# Altium project TIDA-010967_xWRL6432AOP_Module_revB.PrjPcb (part 1 of 3)
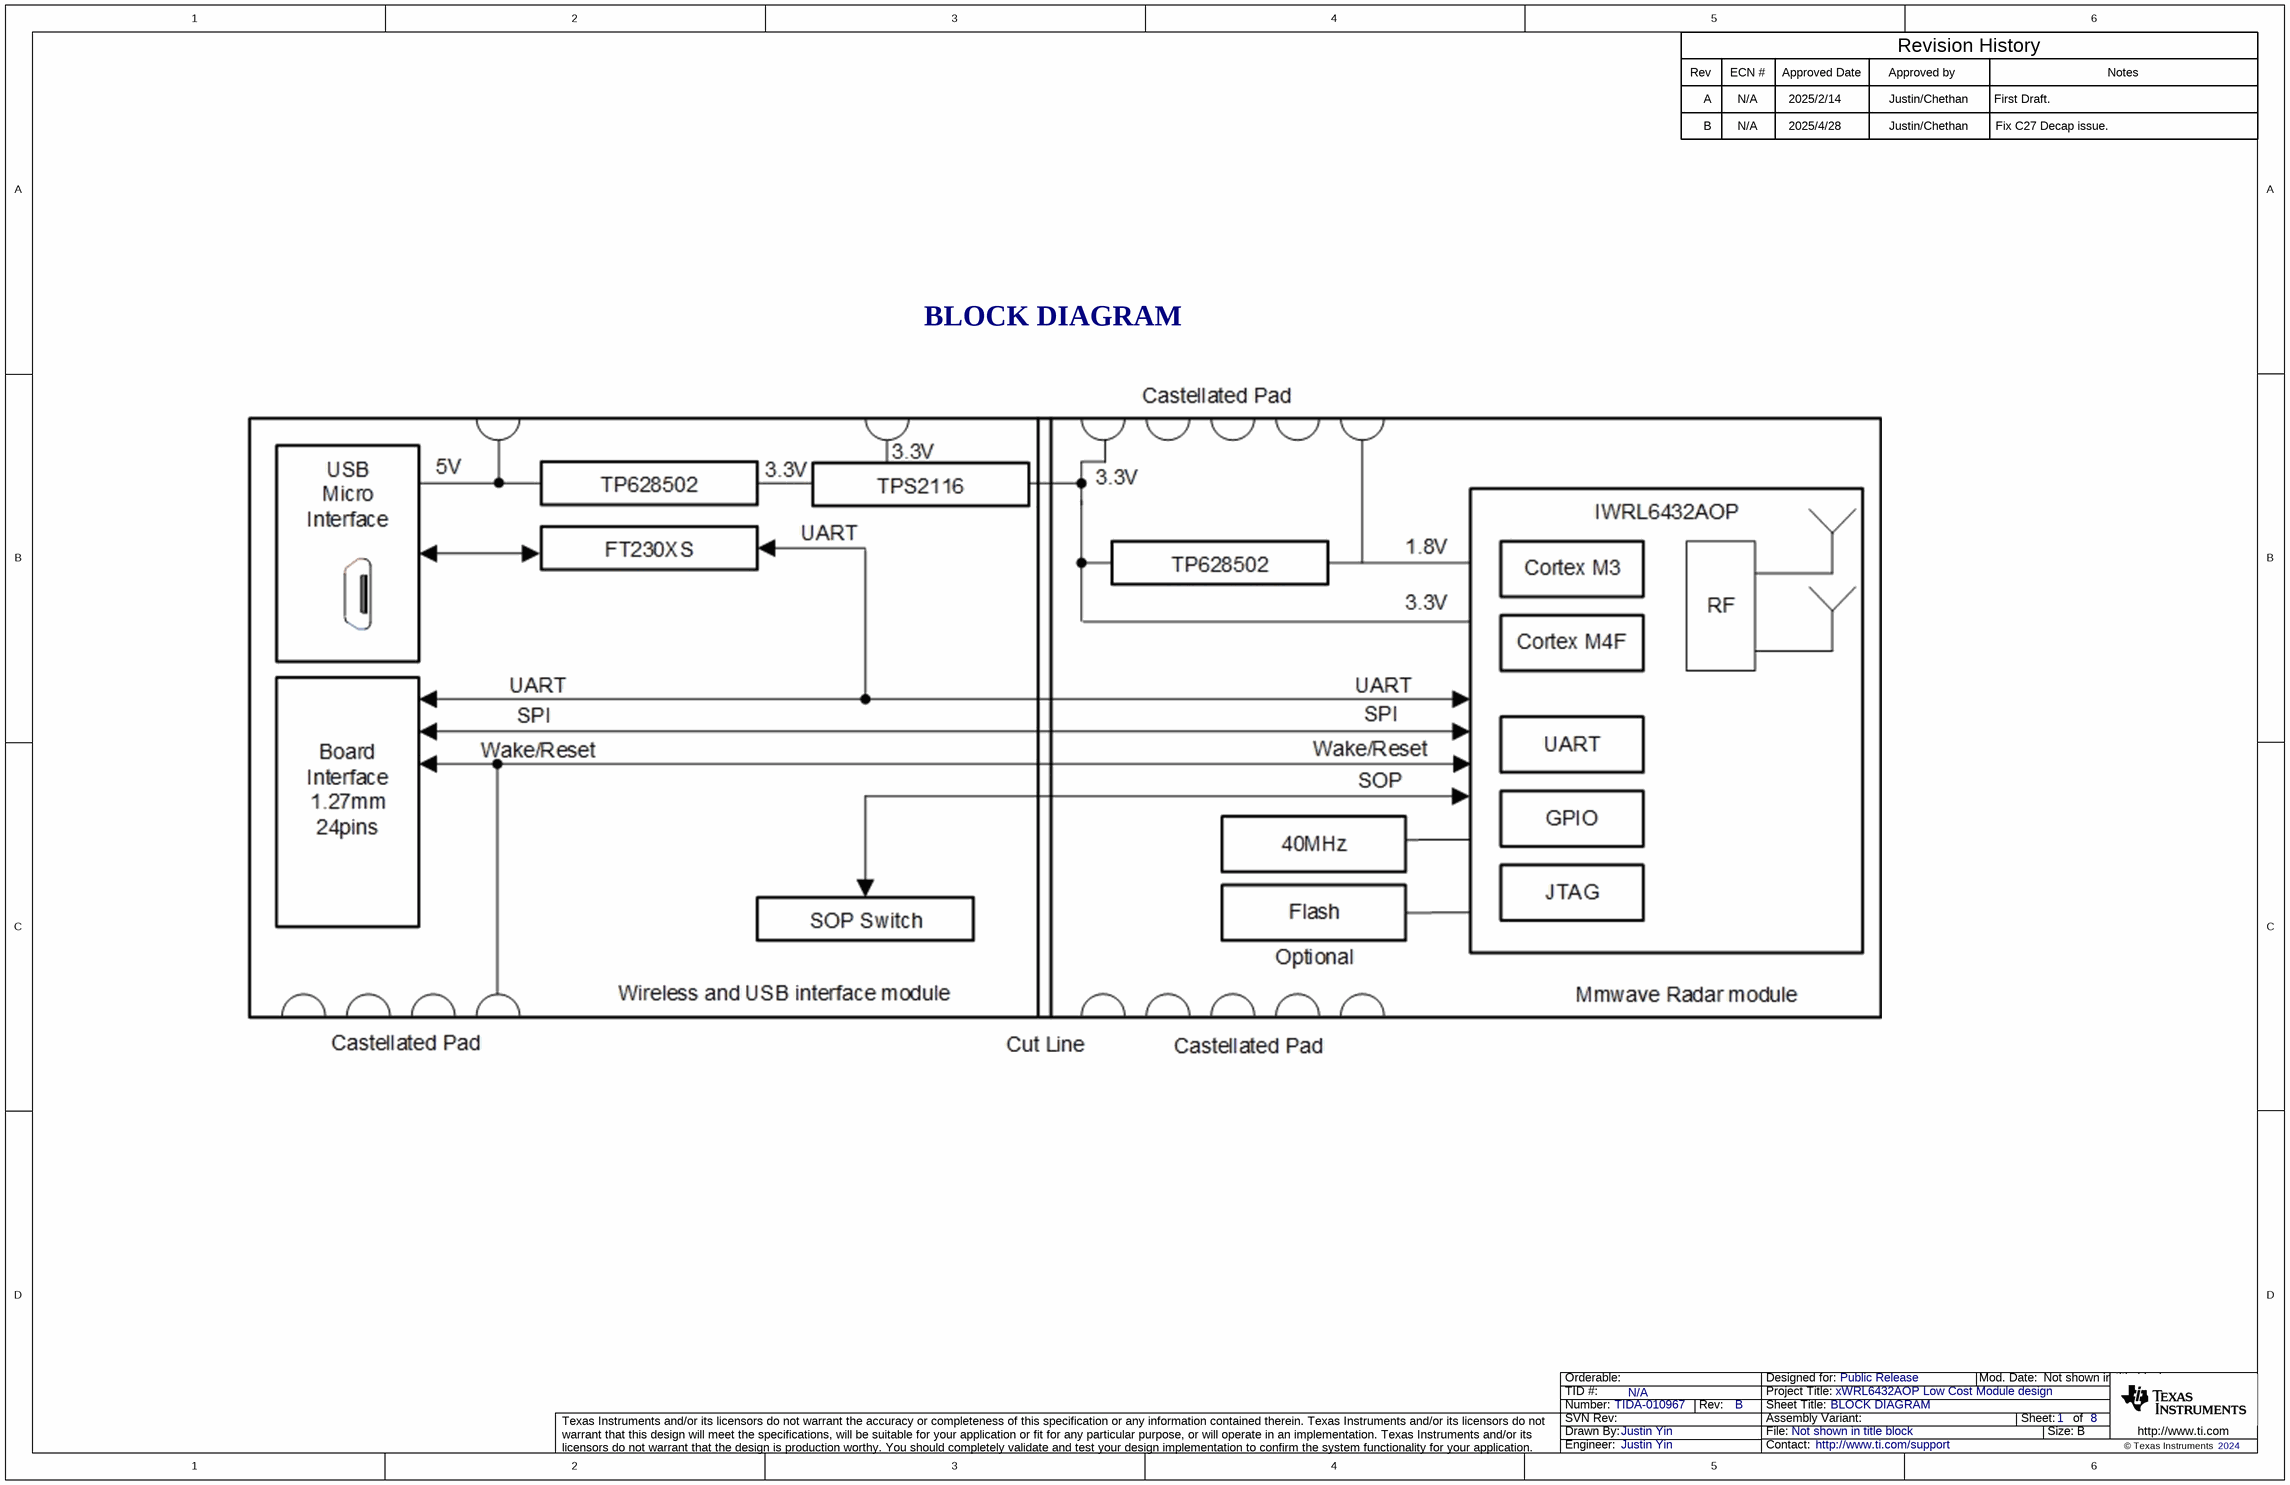
[diagram p0: TIDA-010967_Diagram.SchDoc]
CopyrightYear: 2024; PCB_Layout: Justin Yin; PCB_Rev: B; PRJ_Customer: Public Release; PRJ_Engineer: Justin Yin; PRJ_Number: TIDA-010967; PRJ_Title: xWRL6432AOP Low Cost Module design; SCH_Rev: B; TechSupport: http://www.ti.com/support; TID: N/A
8 sheets, 179 parts. Net scope: flat (ports and power ports of the same name join across sheets).
Board file: TIDA-010967_PCB.PcbDoc
Sheets:
  TIDA-010967_Diagram.SchDoc
  TIDA-010967_Table_Of_Contents.SchDoc
  TIDA-010967_USB_PWR_Connector.SchDoc
  TIDA-010967_DC_Regulators.SchDoc
  TIDA-010967_xWRL6432_Chip.SchDoc
  TIDA-010967_Decoupling_caps.SchDoc
  TIDA-010967_QSPI_Flash.SchDoc
  TIDA-010967_Hardware.SchDoc

## Sheet TIDA-010967_Diagram.SchDoc: BLOCK DIAGRAM
size 431 x 279 mm; Date: Not shown in title block; ApprovedBy: Not shown in title block; CheckedBy: Not shown in title block; Author: Not shown in title block; CompanyName: Not shown in title block; DrawnBy: Justin Yin; Organization: Not shown in title block; Address1: Not shown in title block; Address2: Not shown in title block; Address3: Not shown in title block; Address4: Not shown in title block; DocumentNumber: 1; Revision: Use project parameter SCH_Rev; SheetNumber: 1; SheetTotal: 8; PageSetup: Record=PageOptions|CenterHorizontal=True|CenterVertical=True|PrintScale=1.00|XCorrection=1.00|YCorrection=1.00|PrintKind=0|BorderSize=5000000|LeftOffset=0|BottomOffset=0|Orientation=2|PaperLength=1000|PaperWidth=1000|Scale=100|PaperSource=15|PrintQuality=600|MediaType=1|DitherType=10|PaperKind=Letter|PrintScaleMode=1; CurrentTime: Not shown in title block; CurrentDate: Not shown in title block; Time: Not shown in title block; DocumentFullPathAndName: Not shown in title block; DocumentName: Not shown in title block; ModifiedDate: Not shown in title block; ImagePath: Not shown in title block

### Notes on the sheet
- Rev
- A
- ECN #
- N/A
- 2025/2/14
- Approved Date
- Approved by
- Justin/Chethan
- Revision History
- First Draft.
- Notes
- B
- 2025/4/28
- Fix C27 Decap issue.
- BLOCK DIAGRAM
- Drawn By:
- SVN Rev:
- Number:
- TID #:
- Orderable:
- Rev:
- Sheet Title:
- File:
- Project Title:
- Designed for:
- Assembly Variant:
- Mod. Date:
- Sheet:
- Size:
- of
- http://www.ti.com
- Texas Instruments and/or its licensors do not warrant the accuracy or completeness of this specification or any information contained therein. Texas Instruments and/or its licensors do not warrant that this design will meet the specifications, will be suitable for your application or fit for any particular purpose, or will operate in an implementation. Texas Instruments and/or its licensors do not warrant that the design is production worthy. You should completely validate and test your design implementation to confirm the system functionality for your application.
- Engineer:
- Contact:
- © Texas Instruments

## Sheet TIDA-010967_Table_Of_Contents.SchDoc: TABLE OF CONTENTS
size 431 x 279 mm; Date: Not shown in title block; ApprovedBy: Not shown in title block; CheckedBy: Not shown in title block; Author: Not shown in title block; CompanyName: Not shown in title block; DrawnBy: Justin Yin; Engineer: Not shown in title block; Organization: Not shown in title block; Address1: Not shown in title block; Address2: Not shown in title block; Address3: Not shown in title block; Address4: Not shown in title block; DocumentNumber: 2; Revision: Use project parameter SCH_Rev; SheetNumber: 2; SheetTotal: 8; PageSetup: Record=PageOptions|CenterHorizontal=True|CenterVertical=True|PrintScale=1.00|XCorrection=1.00|YCorrection=1.00|PrintKind=0|BorderSize=5000000|LeftOffset=0|BottomOffset=0|Orientation=2|PaperLength=1000|PaperWidth=1000|Scale=100|PaperSource=15|PrintQuality=600|MediaType=1|DitherType=10|PaperKind=Letter|PrintScaleMode=1; CurrentTime: Not shown in title block; CurrentDate: Not shown in title block; Time: Not shown in title block; DocumentFullPathAndName: Not shown in title block; DocumentName: Not shown in title block; ModifiedDate: Not shown in title block; ImagePath: Not shown in title block
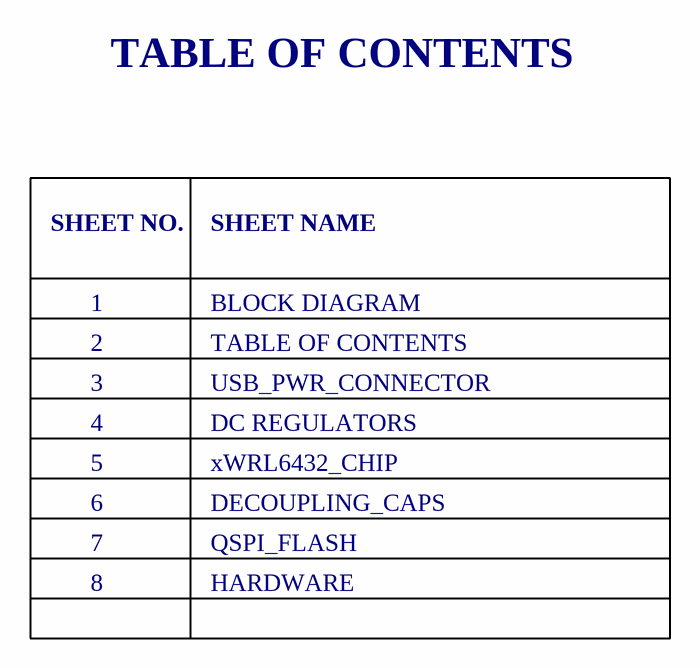
[diagram p1: TIDA-010967_Table_Of_Contents.SchDoc]

### Notes on the sheet
- TABLE OF CONTENTS
- SHEET NO.
- SHEET NAME
- 1
- 2
- 3
- BLOCK DIAGRAM
- USB_PWR_CONNECTOR
- 4
- 5
- DC REGULATORS
- xWRL6432_CHIP
- 7
- 8
- 6
- DECOUPLING_CAPS
- QSPI_FLASH
- HARDWARE
- Drawn By:
- SVN Rev:
- Number:
- TID #:
- Orderable:
- Rev:
- Sheet Title:
- File:
- Project Title:
- Designed for:
- Assembly Variant:
- Mod. Date:
- Sheet:
- Size:
- of
- B
- http://www.ti.com
- Texas Instruments and/or its licensors do not warrant the accuracy or completeness of this specification or any information contained therein. Texas Instruments and/or its licensors do not warrant that this design will meet the specifications, will be suitable for your application or fit for any particular purpose, or will operate in an implementation. Texas Instruments and/or its licensors do not warrant that the design is production worthy. You should completely validate and test your design implementation to confirm the system functionality for your application.
- Engineer:
- Contact:
- © Texas Instruments

## Sheet TIDA-010967_USB_PWR_Connector.SchDoc: USB_PWR_Connector
size 431 x 279 mm; Date: Not shown in title block; ApprovedBy: Not shown in title block; CheckedBy: Not shown in title block; Author: Not shown in title block; CompanyName: Not shown in title block; DrawnBy: Justin Yin; Engineer: Not shown in title block; Organization: Not shown in title block; Address1: Not shown in title block; Address2: Not shown in title block; Address3: Not shown in title block; Address4: Not shown in title block; DocumentNumber: 3; Revision: Use project parameter SCH_Rev; SheetNumber: 3; SheetTotal: 8; PageSetup: Record=PageOptions|CenterHorizontal=True|CenterVertical=True|PrintScale=1.00|XCorrection=1.00|YCorrection=1.00|PrintKind=0|BorderSize=5000000|LeftOffset=0|BottomOffset=0|Orientation=2|PaperLength=1000|PaperWidth=1000|Scale=100|PaperSource=15|PrintQuality=600|MediaType=1|DitherType=10|PaperKind=Letter|PrintScaleMode=1; CurrentTime: Not shown in title block; CurrentDate: Not shown in title block; Time: Not shown in title block; DocumentFullPathAndName: Not shown in title block; DocumentName: Not shown in title block; ModifiedDate: Not shown in title block; ImagePath: Not shown in title block
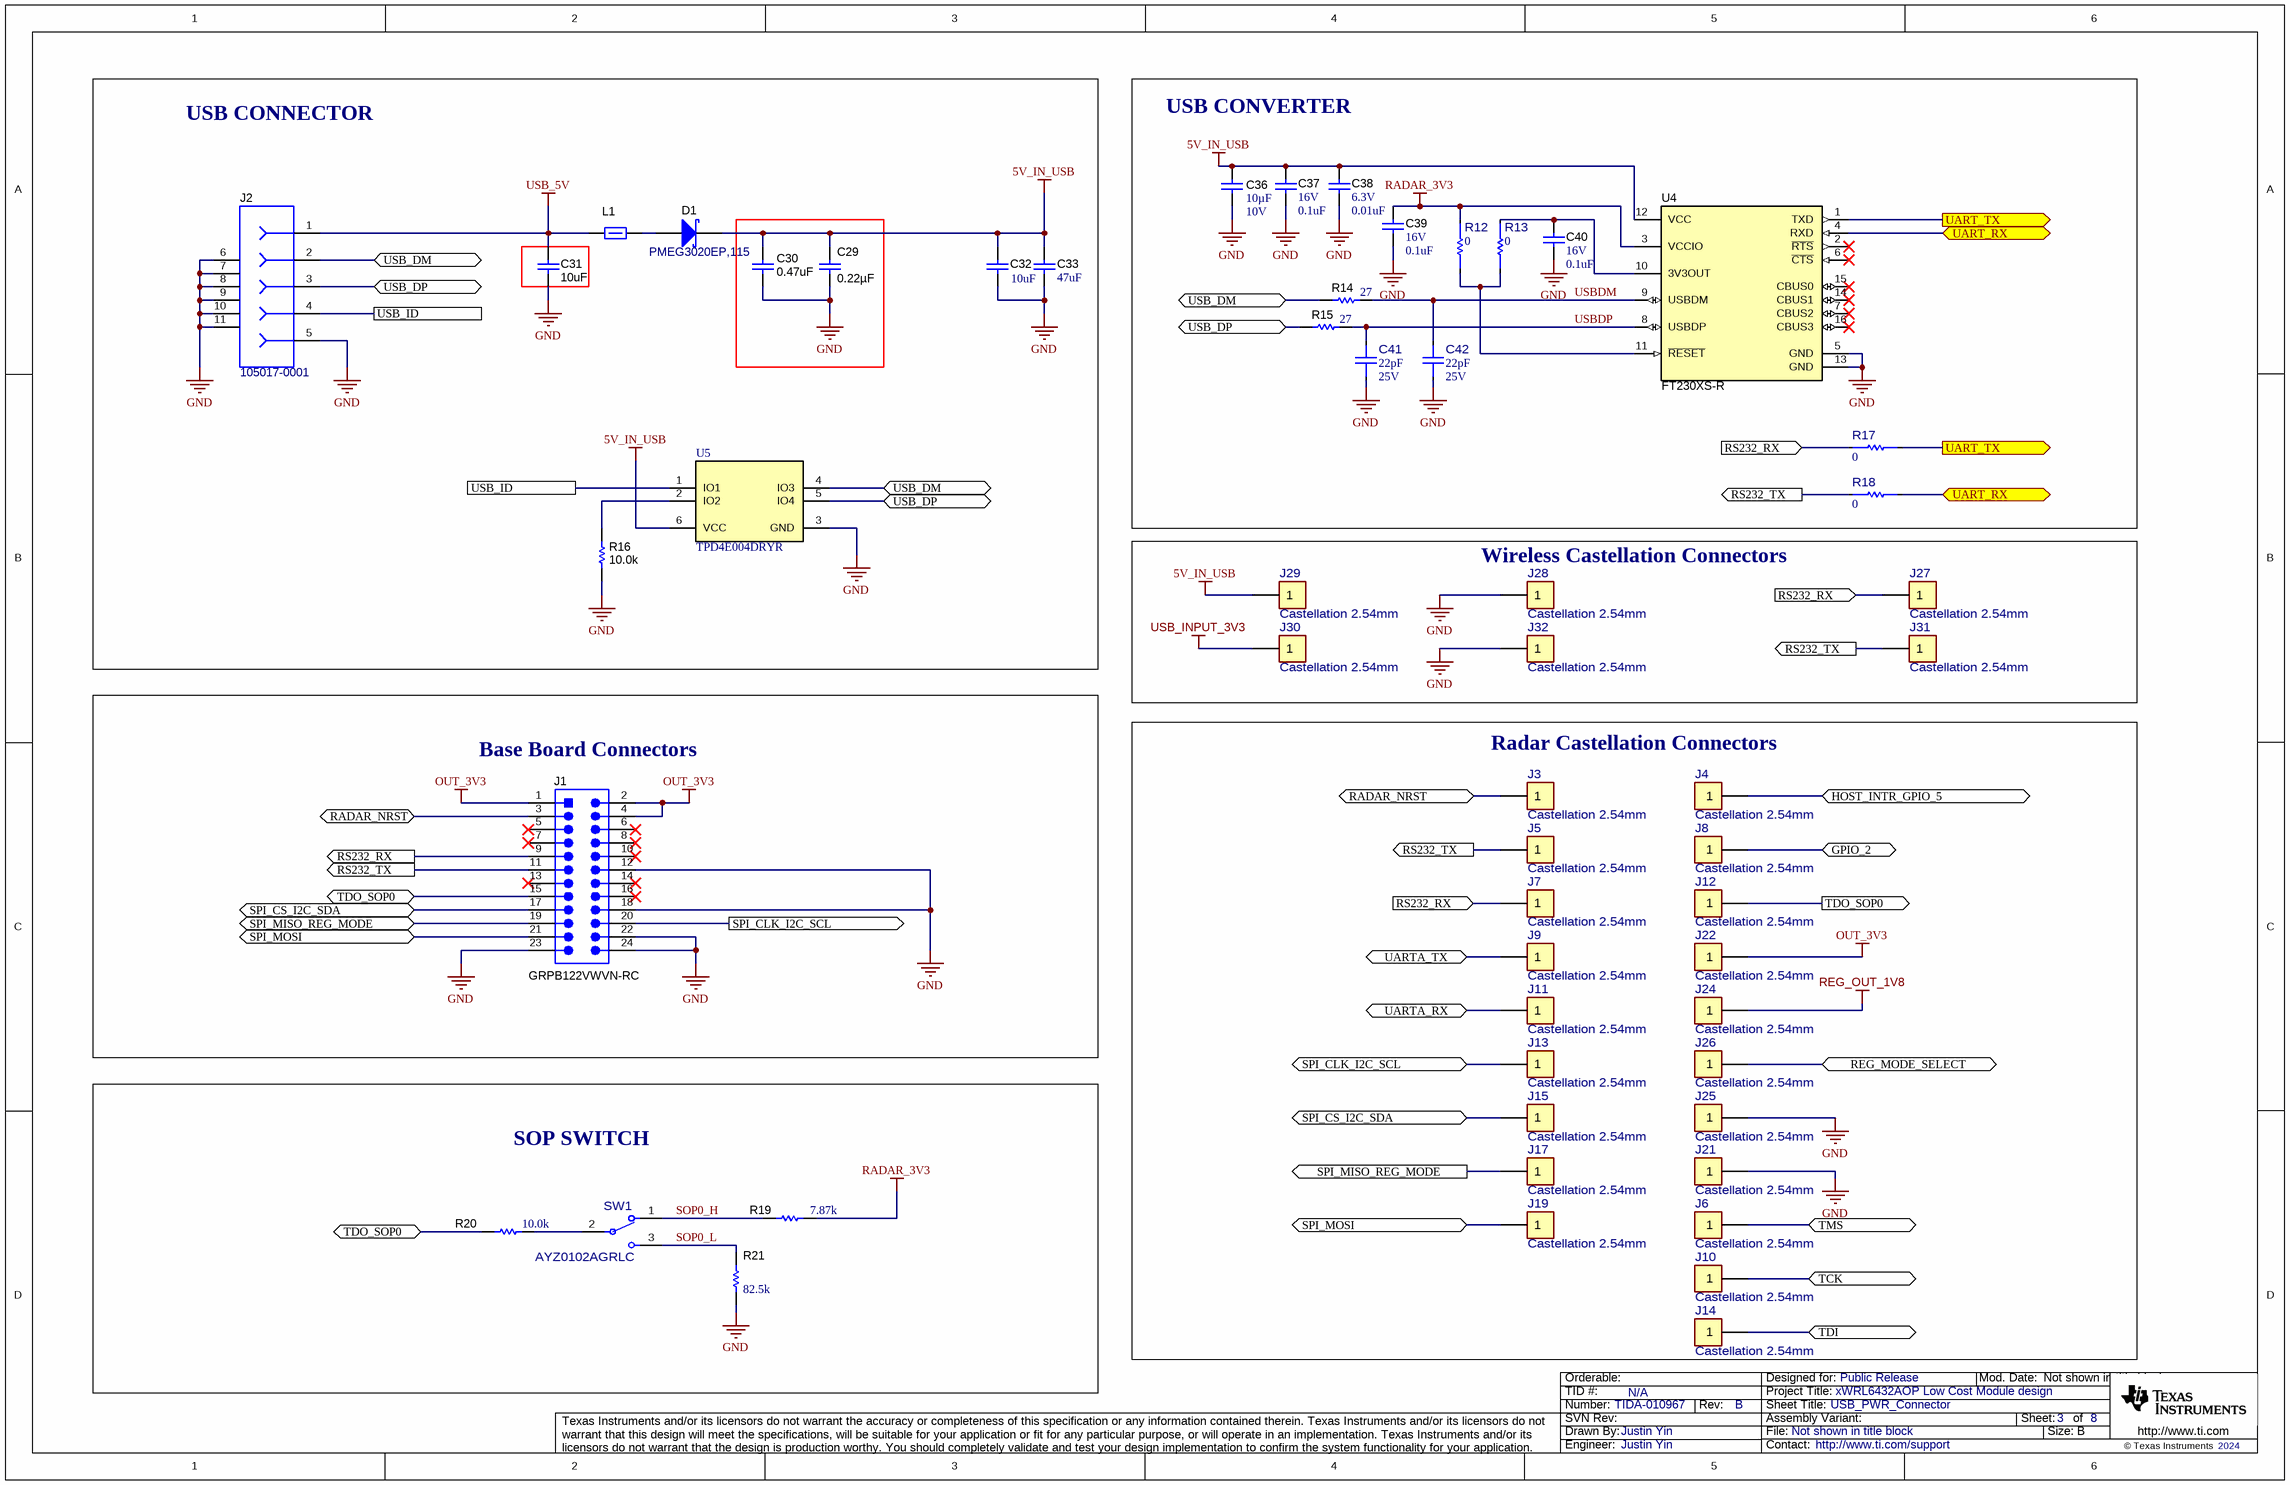
[diagram p2: TIDA-010967_USB_PWR_Connector.SchDoc]

### Parts
C29  ValueDisplayed: 0.22µF  [0402L]  (hidden comment: GCM155R71C224KE02D)
C30  ValueDisplayed: 0.47uF  [0402L]  (hidden comment: GCM155C71A474KE36D)
C31  ValueDisplayed: 10uF  [0603S]  (hidden comment: GRT188R61A106KE13D)
C32  ValueDisplayed: 10uF  [0402]  (hidden comment: GRM155R61A106ME11D)
C33  ValueDisplayed: 47uF  [1206_180]  (hidden comment: GRM31CR61A476KE15L)
C36  VDC_V: 10V  ValueDisplayed: 10µF  [0402_080]  (hidden comment: 0402ZD106MAT2A)
C37  VDC_V: 16V  ValueDisplayed: 0.1uF  [0201_033]  (hidden comment: GRM033R61C104KE84D)
C38  VDC_V: 6.3V  ValueDisplayed: 0.01uF  [0201]  (hidden comment: GRM033R70J103KA01D)
C39  VDC_V: 16V  ValueDisplayed: 0.1uF  [0201_033]  (hidden comment: GRM033R61C104KE84D)
C40  VDC_V: 16V  ValueDisplayed: 0.1uF  [0201_033]  (hidden comment: GRM033R61C104KE84D)
C41  ValueDisplayed: 22pF  VDC_V: 25V  [FP-GCM0335C1E220JA16D_0201-MFG]  (hidden comment: GCM0335C1E220JA16D)
C42  ValueDisplayed: 22pF  VDC_V: 25V  [FP-GCM0335C1E220JA16D_0201-MFG]  (hidden comment: GCM0335C1E220JA16D)
D1  PMEG3020EP,115  [SOD-128]
J1  GRPB122VWVN-RC  [Sullins_GRPB122VWVN]
J2  105017-0001  [CONN_105017-0001]
J3  Castellation 2.54mm  [FP-Castellation 2.54mm_75mills]
J4  Castellation 2.54mm  [FP-Castellation 2.54mm_75mills]
J5  Castellation 2.54mm  [FP-Castellation 2.54mm_75mills]
J6  Castellation 2.54mm  [FP-Castellation 2.54mm_75mills]
J7  Castellation 2.54mm  [FP-Castellation 2.54mm_75mills]
J8  Castellation 2.54mm  [FP-Castellation 2.54mm_75mills]
J9  Castellation 2.54mm  [FP-Castellation 2.54mm_75mills]
J10  Castellation 2.54mm  [FP-Castellation 2.54mm_75mills]
J11  Castellation 2.54mm  [FP-Castellation 2.54mm_75mills]
J12  Castellation 2.54mm  [FP-Castellation 2.54mm_75mills]
J13  Castellation 2.54mm  [FP-Castellation 2.54mm_75mills]
J14  Castellation 2.54mm  [FP-Castellation 2.54mm_75mills]
J15  Castellation 2.54mm  [FP-Castellation 2.54mm_75mills]
J17  Castellation 2.54mm  [FP-Castellation 2.54mm_75mills]
J19  Castellation 2.54mm  [FP-Castellation 2.54mm_75mills]
J21  Castellation 2.54mm  [FP-Castellation 2.54mm_75mills]
J22  Castellation 2.54mm  [FP-Castellation 2.54mm_75mills]
J24  Castellation 2.54mm  [FP-Castellation 2.54mm_75mills]
J25  Castellation 2.54mm  [FP-Castellation 2.54mm_75mills]
J26  Castellation 2.54mm  [FP-Castellation 2.54mm_75mills]
J27  Castellation 2.54mm  [FP-Castellation 2.54mm_75mills]
J28  Castellation 2.54mm  [FP-Castellation 2.54mm_75mills]
J29  Castellation 2.54mm  [FP-Castellation 2.54mm_75mills]
J30  Castellation 2.54mm  [FP-Castellation 2.54mm_75mills]
J31  Castellation 2.54mm  [FP-Castellation 2.54mm_75mills]
J32  Castellation 2.54mm  [FP-Castellation 2.54mm_75mills]
L1  BLM15PD300SZ1D  [0402L]  (value not drawn)
R12  value 0  [FP-RC0402JR-070RP_0402-MFG]  (hidden comment: RC0402JR-070RP)
R13  value 0  [FP-RC0402JR-070RP_0402-MFG]  (hidden comment: RC0402JR-070RP)
R14  ValueDisplayed: 27  [0201]  (hidden comment: RC0201JR-0727RL)
R15  ValueDisplayed: 27  [0201]  (hidden comment: RC0201JR-0727RL)
R16  ValueDisplayed: 10.0k  [0402L]  (hidden comment: CRCW040210K0FKED)
R17  value 0  [FP-RC0402JR-070RP_0402-MFG]  (hidden comment: RC0402JR-070RP)
R18  value 0  [FP-RC0402JR-070RP_0402-MFG]  (hidden comment: RC0402JR-070RP)
R19  ValueDisplayed: 7.87k  [0402L]  (hidden comment: CRCW04027K87FKED)
R20  ValueDisplayed: 10.0k  [0402L]  (hidden comment: CRCW040210K0FKED)
R21  ValueDisplayed: 82.5k  [0402L]  (hidden comment: CRCW040282K5FKED)
SW1  AYZ0102AGRLC  [FP-AYZ0102AGRLC_SMT_SW_7MM2_5MM3-MFG]
U4  FT230XS-R  [SSOP-16]
U5  TPD4E004DRYR  [DRY0006A]

### Blocks framed on the sheet
USB CONNECTOR: C29-C33 D1 J2 L1 R16 U5
USB CONVERTER: C36-C42 R12-R15 R17 R18 U4
Wireless Castellation Connectors: J27-J32
Base Board Connectors: J1
Radar Castellation Connectors: J3-J15 J17 J19 J21 J22 J24-J26
SOP SWITCH: R19-R21 SW1

### Ports
GPIO_2 (bidir), HOST_INTR_GPIO_5 (bidir), RADAR_NRST (bidir), REG_MODE_SELECT (bidir), RS232_RX (in), RS232_RX (out), RS232_TX (out), SPI_CLK_I2C_SCL (bidir), SPI_CLK_I2C_SCL (out), SPI_CS_I2C_SDA (bidir), SPI_MISO_REG_MODE (bidir), SPI_MISO_REG_MODE (out), SPI_MOSI (bidir), TCK (bidir), TDI (bidir), TDO_SOP0 (bidir), TDO_SOP0 (out), TMS (bidir), UART_RX (bidir), UART_TX (out), UARTA_RX (bidir), UARTA_TX (bidir), USB_DM (bidir), USB_DP (bidir), USB_ID

### Nets
5V_IN_USB: C29.2 C30.1 C32.2 C33.1 C36.1 C37.1 C38.1 D1.1(K) J29.1 U4.12(VCC) U5.6(VCC)
GND: C29.1 C30.2 C31.1 C32.1 C33.2 C36.2 C37.2 C38.2 C39.2 C40.2 C41.1 C42.1 J1.12 J1.18 J1.22 J1.23 J1.24 J2.5 J2.6 J2.7 J2.8 J2.9 J2.10 J2.11 J21.1 J25.1 J28.1 J32.1 R16.1 R21.1 U4.5(GND) U4.13(GND) U5.3(GND)
OUT_3V3: J1.1 J1.2 J1.4 J22.1
RADAR_3V3: C39.1 R12.1 R19.2 U4.3(VCCIO)
REG_OUT_1V8: J24.1
USB_5V: C31.2 J2.1 L1.1
USB_INPUT_3V3: J30.1
GPIO_2: J8.1 ; port GPIO_2
HOST_INTR_GPIO_5: J4.1 ; port HOST_INTR_GPIO_5
RADAR_NRST: J1.3 J3.1 ; port RADAR_NRST
REG_MODE_SELECT: J26.1 ; port REG_MODE_SELECT
RS232_RX: J1.9 J7.1 J27.1 R17.1 ; port RS232_RX
RS232_TX: J1.11 J5.1 J31.1 R18.1 ; port RS232_TX
SOP0_H: R19.1 SW1.1
SOP0_L: R21.2 SW1.3
SPI_CLK_I2C_SCL: J1.20 J13.1 ; port SPI_CLK_I2C_SCL
SPI_CS_I2C_SDA: J1.17 J15.1 ; port SPI_CS_I2C_SDA
SPI_MISO_REG_MODE: J1.19 J17.1 ; port SPI_MISO_REG_MODE
SPI_MOSI: J1.21 J19.1 ; port SPI_MOSI
TCK: J10.1 ; port TCK
TDI: J14.1 ; port TDI
TDO_SOP0: J1.15 J12.1 R20.1 ; port TDO_SOP0
TMS: J6.1 ; port TMS
UART_RX: R18.2 U4.4(RXD) ; port UART_RX
UART_TX: R17.2 U4.1(TXD) ; port UART_TX
UARTA_RX: J11.1 ; port UARTA_RX
UARTA_TX: J9.1 ; port UARTA_TX
USB_DM: J2.2 R14.1 U5.4(IO3) ; port USB_DM
USB_DP: J2.3 R15.1 U5.5(IO4) ; port USB_DP
USB_ID: J2.4 U5.1(IO1) ; port USB_ID
USBDM: C42.2 R14.2 U4.9(USBDM)
USBDP: C41.2 R15.2 U4.8(USBDP)
NetC40_1: C40.1 R13.1 U4.10(3V3OUT)
NetD1_2: D1.2(A) L1.2
NetR12_2: R12.2 R13.2 U4.11(~{RESET})
NetR16_2: R16.2 U5.2(IO2)
NetR20_2: R20.2 SW1.2(C)

Not connected (* = marked no-connect by the designer): J1 5* 6* 7* 8* 10* 13* 14* 16*; U4 2(~{RTS})* 6(~{CTS})* 7(CBUS2)* 14(CBUS1)* 15(CBUS0)* 16(CBUS3)*

### Notes on the sheet
- Drawn By:
- SVN Rev:
- Number:
- TID #:
- Orderable:
- Rev:
- Sheet Title:
- File:
- Project Title:
- Designed for:
- Assembly Variant:
- Mod. Date:
- Sheet:
- Size:
- of
- B
- http://www.ti.com
- Texas Instruments and/or its licensors do not warrant the accuracy or completeness of this specification or any information contained therein. Texas Instruments and/or its licensors do not warrant that this design will meet the specifications, will be suitable for your application or fit for any particular purpose, or will operate in an implementation. Texas Instruments and/or its licensors do not warrant that the design is production worthy. You should completely validate and test your design implementation to confirm the system functionality for your application.
- Engineer:
- Contact:
- © Texas Instruments

### Library data of the parts
C29 = CMP-0078265-1: CAP, CERM, 0.22 µF, 16 V,+/- 10%, X7R, AEC-Q200 Grade 1, 0402; Manufacturer: MuRata; TaMin_C: -55°C; Polarized: N; SizeAreaWB_mm2: 3; U/M: EA; Value: 0.22uF; TaMax_C: 125°C; SizeZ_mm: 0.6; SizeX_mm: 1; SizeY_mm: 0.5; Cap_Case: 0402; Value2: 16V; CompType: Capacitor; AEC Qualified: Y; Cap_F: 220nF; AEC Category: Q200; ComponentLink1URL: http://psearch.en.murata.com/capacitor/product/GCM155R71C224KE02%23.pdf; Supplier Part Number 2: 81-GCM155R71C224KE2D; Supplier 2: Mouser; TempCo: X7R; RoHS: Y; MountType: SMT; Supplier 1: Digi-Key; PackageReference: 0402; Tolerance_%: 10%; SizeArea_mm2: 0.5; PartNumber: GCM155R71C224KE02D; VDC_V: 16V; ComponentLink1Description: Datasheet link; AEC Grade: 1; Supplier Part Number 1: 490-10671-1-ND; Technology: Ceramic
C30 = CMP-0064967-2: CAP, CERM, 0.47 uF, 10 V,+/- 10%, X7S, 0402; Manufacturer: MuRata; Polarized: N; Value: 0.47uF; U/M: EA; Cap_F: 470nF; Value1: Unknown; VDC_V: 10V; TaMin_C: -55°C; TaMax_C: 125°C; Cap_Case: 0402; SizeArea_mm2: 0.5; SizeAreaWB_mm2: 3; SizeX_mm: 1; SizeZ_mm: 0.6; AEC Category: Q200; CompType: Capacitor; PartNumber: GCM155C71A474KE36D; PackageReference: 0402; RoHS: Y; Tolerance_%: 10%; Value2: 10V; MountType: SMT; Technology: Ceramic; TempCo: X7S; SizeY_mm: 0.5; Published: 2008-06-19; Publisher: Texas Instruments; LatestRevisionDate: 2017-06-05; ComponentLink1Description: Datasheet link; ComponentLink1URL: http://search.murata.co.jp/Ceramy/image/img/A01X/G101/ENG/GCM155C71A474KE36-01.pdf; Supplier 1: Digi-Key; Supplier Part Number 1: 490-14427-1-ND; Supplier 2: Mouser; Supplier Part Number 2: 81-GCM155C71A474KE6D; AEC Qualified: N; AEC Grade: N/A
C31 = CMP-0007497-5: CAP, CERM, 10 uF, 10 V, +/- 10%, X5R, 0603; Manufacturer: MuRata; Polarized: N; Value: 10uF; U/M: EA; Cap_F: 10µF; Tolerance_%: 20%; Value1: Unknown; VDC_V: 10V; TempCo: X7R; TaMin_C: -55°C; TaMax_C: 125°C; Cap_Case: 0603; SizeArea_mm2: 1.28; SizeAreaWB_mm2: 4.68; SizeX_mm: 1.6; SizeY_mm: 0.8; SizeZ_mm: 1; AEC Category: Q200; CompType: Capacitor; PartNumber: GRT188R61A106KE13D; PackageReference: 0603; RoHS: Y; Value2: 10V; MountType: SMT; Technology: Ceramic; Published: 2008-06-19; Publisher: Texas Instruments; LatestRevisionDate: 2017-03-09; ComponentLink1Description: Datasheet link; ComponentLink1URL: http://psearch.en.murata.com/capacitor/product/GRM188Z71A106MA73%23.pdf; Supplier 1: Mouser; Supplier Part Number 1: 81-GRM188Z71A106MA3D; AEC Qualified: N; AEC Grade: N/A
C32 = CMP-0006564-3: CAP, CERM, 10 uF, 10 V, +/- 20%, X5R, 0402; Manufacturer: MuRata; TaMin_C: -55°C; Polarized: N; SizeAreaWB_mm2: 3; Value1: Unknown; U/M: EA; Value: 10uF; TaMax_C: 85°C; SizeZ_mm: 0.6; SizeX_mm: 1; SizeY_mm: 0.5; Value2: 10V; Cap_F: 10µF; AEC Category: Q200; Publisher: Texas Instruments; TempCo: X5R; Published: 2008-06-19; RoHS: Y; MountType: SMT; PackageReference: 0402; Tolerance_%: 20%; Cap_Case: 0402; SizeArea_mm2: 0.5; CompType: Capacitor; LatestRevisionDate: 2017-03-09; PartNumber: GRM155R61A106ME11D; AEC Qualified: ?; VDC_V: 10V; ComponentLink1Description: Datasheet link; Technology: Ceramic; ComponentLink1URL: https://sps06.itg.ti.com/sites/KMS/crossdivteams/altium/docs/ComponentDatasheets/GRM155R61A106ME11 Electrical Characteristics Data.pdf
C33 = CMP-0008944-2: CAP, CERM, 47 uF, 10 V, +/- 10%, X5R, 1206; Manufacturer: MuRata; TaMin_C: -55°C; Polarized: N; SizeAreaWB_mm2: 10.92; Value1: Unknown; U/M: EA; Value: 47uF; TaMax_C: 85°C; SizeZ_mm: 1.8; SizeX_mm: 3.2; SizeY_mm: 1.6; Cap_Case: 1206; Value2: 10V; SizeArea_mm2: 5.12; Cap_F: 47µF; AEC Category: Q200; Publisher: Texas Instruments; TempCo: X5R; Published: 2008-06-19; RoHS: Y; MountType: SMT; Supplier 1: Mouser; PackageReference: 1206; Tolerance_%: 10%; CompType: Capacitor; LatestRevisionDate: 2017-03-09; PartNumber: GRM31CR61A476KE15L; AEC Qualified: ?; VDC_V: 10V; ComponentLink1Description: Datasheet link; Supplier Part Number 1: 81-GRM31CR61A476KE5L; Technology: Ceramic; ComponentLink1URL: http://search.murata.co.jp/Ceramy/PnsearchViewAction.do?HnOFG=ON&HnNFG=ON&SEL_CNT=50&sLang=en&sKey=GRM31CR61A476KE15L&x=9&y=9&search=startwith
C36 = CMP-0078623-1: CAP, CERM, 10 µF, 10 V,+/- 20%, X5R, 0402; Manufacturer: AVX; Value: 10uF; Polarized: N; SizeAreaWB_mm2: 3; SizeArea_mm2: 0.5; AEC Category: Q200; TaMax_C: 85°C; SizeZ_mm: 0.8; TaMin_C: -55°C; U/M: EA; SizeX_mm: 1; CompType: Capacitor; ComponentLink1Description: Datasheet link; Cap_F: 10µF; RoHS: Y; Tolerance_%: 20%; Supplier 1: Digi-Key; AEC Qualified: N; PackageReference: 0402; Technology: Ceramic; PartNumber: 0402ZD106MAT2A; TempCo: X5R; Supplier Part Number 2: 581-0402ZD106MAT2A; Supplier 2: Mouser; AEC Grade: N/A; SizeY_mm: 0.5; Value2: 10V; ComponentLink1URL: http://datasheets.avx.com/cx5r.pdf; MountType: SMT; Supplier Part Number 1: 478-10052-1-ND; Cap_Case: 0402_080
C37 C39 C40 = CMP-0009717-2: CAP, CERM, 0.1 uF, 16 V, +/- 10%, X5R, 0201; Manufacturer: MuRata; TaMin_C: -55°C; Polarized: N; SizeAreaWB_mm2: 2.08; Value1: Unknown; U/M: EA; Value: 0.1uF; TaMax_C: 85°C; SizeZ_mm: 0.33; SizeX_mm: 0.6; SizeY_mm: 0.3; Cap_Case: 0201; SizeArea_mm2: 0.18; Cap_F: 100nF; AEC Category: Q200; Supplier Part Number 2: 81-GRM33R61C104KE84D; Publisher: Texas Instruments; Supplier 2: Mouser; TempCo: X5R; Published: 2008-06-19; RoHS: Y; MountType: SMT; Supplier 1: Digi-Key; PackageReference: 0201; Tolerance_%: 10%; Value2: 16V; CompType: Capacitor; LatestRevisionDate: 2017-03-09; PartNumber: GRM033R61C104KE84D; AEC Qualified: N; ComponentLink1Description: Datasheet link; AEC Grade: N/A; Supplier Part Number 1: 490-9985-1-ND; Technology: Ceramic; ComponentLink1URL: http://psearch.en.murata.com/capacitor/product/GRM033R61C104KE84%23.pdf
C38 = CMP-0009720-2: CAP, CERM, 0.01 uF, 6.3 V, +/- 10%, X7R, 0201; Manufacturer: MuRata; TaMin_C: -55°C; Polarized: N; SizeAreaWB_mm2: 2.08; Value1: Unknown; U/M: EA; Value: 0.01uF; TaMax_C: 125°C; SizeZ_mm: 0.26; SizeX_mm: 0.6; SizeY_mm: 0.3; SizeArea_mm2: 0.18; Cap_F: 10nF; AEC Category: Q200; ComponentLink1URL: http://search.murata.co.jp/Ceramy/PnsearchViewAction.do?HnOFG=ON&HnNFG=ON&SEL_CNT=50&sLang=en&sKey=GRM033R70J103KA01D&x=9&y=9&search=startwith; Supplier Part Number 2: 81-GRM033R70J103KA1D; Publisher: Texas Instruments; Supplier 2: Mouser; TempCo: X7R; Published: 2008-06-19; RoHS: Y; MountType: SMT; Supplier 1: Digi-Key; PackageReference: 0201; Tolerance_%: 10%; Cap_Case: 0201; Value2: 6.3V; CompType: Capacitor; LatestRevisionDate: 2017-03-09; PartNumber: GRM033R70J103KA01D; AEC Qualified: ?; ComponentLink1Description: Datasheet link; Supplier Part Number 1: 490-1262-1-ND; Technology: Ceramic
C41 C42 = CMP-0124498-1: Ceramic Capacitor for Automotive 22pF  ±5% 25VDC C0G 0201 Paper T/R; Manufacturer: Murata; AEC Grade: Grade 1; AEC Qualified: Yes; SizeZ_mm: 0.33mm; TempCo: 30ppm/°C; Tolerance_%: 0.05%; Cap_F: 22pF; PackageReference: 0201; PartNumber: GCM0335C1E220JA16D; RoHS: TRUE; Part Number: GCM0335C1E220JA16D; datasheet: https://www.murata.com/en-us/products/productdetail?partno=GCM0335C1E220JA16%23; Datasheet Path: datasheets/Cap-GCM0335C1E220JA16D.pdf; helpURL: https://upverter.com/upn/revision/7c4daa696f5ee5c6/; Lead Free: Yes; Operating Temperature Range: -55°C to +125°C; Temperature Characteristic: C0G; Value: 22pF; ComponentLink1Description: Datasheet; ComponentLink1URL: https://www.murata.com/en-us/products/productdetail?partno=GCM0335C1E220JA16%23
D1 = CMP-0078758-2: Diode, Schottky, 30 V, 2 A, AEC-Q101, SOD-128; Manufacturer: Nexperia; Value2: 0.36V; SizeAreaWB_mm2: 19.6; Io_A: 2A; Value: 30V; AEC Qualified: Y; TJmax_C: 150°C; SizeX_mm: 4.6; AEC Category: Q101; SizeY_mm: 2.5; SizeArea_mm2: 11.5; Vf_V: 3.6dV; SizeZ_mm: 1.1; RoHS: Y; ComponentLink1Description: Datasheet link; Vr_V: 30V; CompType: Diode; PackageReference: SOD-128; ComponentLink1URL: https://assets.nexperia.com/documents/data-sheet/PMEG3020EP.pdf; Type: Schottky; MountType: SMT; PartNumber: PMEG3020EP,115; Value1: 2A
J1 = CMP-0054595-1: Header, 1.27mm, 12x2, Gold, TH; Manufacturer: Sullins Connector Solutions; CNHeader: TRUE; Current_A: 1A; Gender: Male; Row_Count: 2; RowSpacing_mm: 1.27; CT: FALSE; Cert_UL: Y; ComponentLink1URL: http://www.sullinscorp.com/catalogs/82_PAGE90-91_.050_MALE_HDR_ST_RA_SMT.pdf; ClassName: Header; Publisher: Texas Instruments; RoHS: Y; MountType: TH; Supplier 1: Digi-Key; PackageReference: Header, 1.27mm, 12x2, TH; PinCount: 12; CompType: Header; LatestRevisionDate: 26/05/2017; PartNumber: GRPB122VWVN-RC; Orientation: Vertical; ComponentLink1Description: Datasheet URL; Supplier Part Number 1: S9015E-12-ND; Pitch_mm: 1.27; ContactFinish: Gold
J2 = CMP-0055293-1: Connector, Receptacle, Micro-USB Type B, R/A, Bottom Mount SMT; Manufacturer: Molex; CNHeader: FALSE; CompType: USB; CT: TRUE; Gender: Female; Green_Lifecycle: Active; Green_REACh: Passed; RoHS: Y; ComponentLink1Description: Datasheet URL; ComponentLink1URL: http://www.molex.com/pdm_docs/sd/1050170001_sd.pdf; Green_EU RoHS-2: Passed; Green_EU RoHS: Passed; LatestRevisionDate: 26/05/2017; MountType: SMT; PackageReference: Micro USB receptacle; PartNumber: 105017-0001; Publisher: Texas Instruments; Supplier 1: Digi-Key; Supplier 2: Newark; Supplier 3: Mouser; Supplier Part Number 1: WM1399CT-ND; Supplier Part Number 2: 78R1699; Supplier Part Number 3: 538-105017-0001
J3-J15 J17 J19 J21 J22 J24-J32 = CMP-0124126-3: Manufacturer: Altium; Conn Gender: NA; PackageReference: CASTELLED_TERM; PartNumber: Castellation 2.54mm; PinCount: 1; RoHS: UNKNOWN; Part Number: Castellation 2.54mm; Datasheet Path: datasheets/Conn-Castellation 2.54mm.pdf; helpURL: https://upverter.com/upn/revision/e505193ec818b83a/; Operating Temperature Range: to
L1 = CMP-0078934-1: Inductor, Ferrite Bead, Ferrite, 2.2 A, 0.035 ohm, AEC-Q200 Grade 1, SMD; Manufacturer: MuRata; AEC Category: Q200; AEC Grade: 1; AEC Qualified: Y; DCR_ohm: 0.035; Imax_A: 2.2A; SizeArea_mm2: 0.5; SizeAreaWB_mm2: 3; SizeZ_mm: 0.6; RoHS: Y; ComponentLink1Description: Datasheet link; ComponentLink1URL: https://www.murata.com/en-us/products/productdata/8796748677150/QNFA9118.pdf; CompType: Inductor; LatestRevisionDate: 2017-12-07; Material: Ferrite; MountType: SMT; PackageReference: 0402; PartNumber: BLM15PD300SZ1D; Published: 2008-06-26; Publisher: Texas Instruments; SizeX_mm: 1; SizeY_mm: 0.5; Supplier 1: Digi-Key; Supplier 2: Mouser; Supplier Part Number 1: 490-16506-1-ND; Supplier Part Number 2: 81-BLM15PD300SZ1D; Technology: Ferrite Bead; Value1: 0.035 ohm; Value2: 2.2A
R12 R13 R17 R18 = CMP-0093147-1: Res Jumper Thick Film 0402 0 Ohm 5% 1/16W Molded SMD Paper T/R; Manufacturer: Yageo; AEC Qualified: No; Power_W: 63mW; SizeZ_mm: 0.4mm; VDC_V: 50V; ComponentLink1URL: https://www.yageo.com/upload/media/product/productsearch/datasheet/rchip/PYu-RC_51_RoHS_P_2.pdf; RoHS: TRUE; Mouser Part Number: 603-RC0402JR-070RP; helpURL: https://upverter.com/upn/revision/1e1ee5977c47aafb/; Supplier Part Number 2: 603-RC0402JR-070RP; Res_ohm: 0; Supplier Part Number 1: YAG1279CT-ND; Technology: Thick Film; Datasheet Path: datasheets/Res-RC0402JR-070RP.pdf; Lead Free: Yes; Part Number: RC0402JR-070RP; ComponentLink1Description: Datasheet; Supplier 1: Digikey; PartNumber: RC0402JR-070RP; Mouser Description: RC Series 0402 Jumper Thick Film Chip Resistor; Operating Temperature Range: -55°C to +155°C; datasheet: https://www.yageo.com/upload/media/product/productsearch/datasheet/rchip/PYu-RC_51_RoHS_P_2.pdf; PackageReference: 0402; Digikey Part Number: YAG1279CT-ND; Digikey Description: RES SMD 0 OHM JUMPER 1/16W 0402; Series: RC_P; Supplier 2: Mouser
R14 R15 = CMP-0027082-3: RES, 27, 5%, 0.05 W, 0201; Manufacturer: Yageo America; Power_W: 50mW; TempCo: 200 ppm/C; Value_Code: 27R0; U/M: EA; Value: 27; EIA_Code: E24; SizeX_mm: 0.6; SizeY_mm: 0.3; SizeZ_mm: 0.26; Value2: 0.05W; SizeArea_mm2: 0.18; AEC Qualified: N; VDC_V: 25V; AEC Category: Q200; Supplier Part Number 2: 603-RC0201JR-0727RL; Publisher: Texas Instruments; Supplier 2: Mouser; Published: 2016-10-14; RoHS: Y; Value1: 5%; MountType: SMT; Supplier 1: Digi-Key; PackageReference: 0201; Tolerance_%: 5%; Res_ohm: 27; CompType: Resistor; LatestRevisionDate: 2017-03-09; PartNumber: RC0201JR-0727RL; ComponentLink1Description: Datasheet link; AEC Grade: N/A; Supplier Part Number 1: YAG2291CT-ND; Technology: Thick Film; ComponentLink1URL: http://www.yageo.com/documents/recent/PYu-RC_Group_51_RoHS_L_5.pdf
R16 R20 = CMP-0025958-3: RES, 10.0 k, 1%, 0.063 W, AEC-Q200 Grade 0, 0402; Manufacturer: Vishay-Dale; Power_W: 63mW; TempCo: 100 ppm/C; Value_Code: 10k0; Value: 10.0k; EIA_Code: E96; Res_ohm: 10k; SizeX_mm: 1; SizeY_mm: 0.5; SizeZ_mm: 0.6; Value2: 0.063W; AEC Qualified: Y; VDC_V: 50V; AEC Category: Q200; AEC Grade: 0; Supplier Part Number 2: 52K6595; Supplier 2: Newark; Supplier Part Number 3: 71-CRCW0402-10K-E3; Supplier 3: Mouser; RoHS: E; Value1: 1%; MountType: SMT; Supplier 1: Digi-Key; PackageReference: 0402; Tolerance_%: 1%; SizeArea_mm2: 0.5; CompType: Resistor; PartNumber: CRCW040210K0FKED; ComponentLink1Description: Datasheet link; Supplier Part Number 1: 541-10.0KLCT-ND; Technology: Thick Film; ComponentLink1URL: http://www.vishay.com/docs/20035/dcrcwe3.pdf
R19 = CMP-0026557-2: RES, 7.87 k, 1%, 0.063 W, AEC-Q200 Grade 0, 0402; Manufacturer: Vishay-Dale; Power_W: 63mW; TempCo: 100 ppm/C; Value_Code: 7k87; Value: 7.87k; EIA_Code: E96; SizeX_mm: 1; SizeY_mm: 0.5; SizeZ_mm: 0.6; Value2: 0.063W; AEC Qualified: Y; VDC_V: 50V; AEC Grade: 0; AEC Category: Q200; ComponentLink1URL: http://www.vishay.com/docs/20035/dcrcwe3.pdf; Supplier Part Number 2: 52K7249; Supplier 2: Newark; Supplier Part Number 3: 71-CRCW0402-7.87K-E3; Supplier 3: Mouser; RoHS: E; Value1: 1%; MountType: SMT; Supplier 1: Digi-Key; PackageReference: 0402; Tolerance_%: 1%; Res_ohm: 7.87k; SizeArea_mm2: 0.5; CompType: Resistor; PartNumber: CRCW04027K87FKED; ComponentLink1Description: Datasheet link; Supplier Part Number 1: 541-7.87KLCT-ND; Technology: Thick Film
R21 = CMP-0026574-2: RES, 82.5 k, 1%, 0.063 W, AEC-Q200 Grade 0, 0402; Manufacturer: Vishay-Dale; Power_W: 63mW; TempCo: 100 ppm/C; Value_Code: 82k5; Value: 82.5k; EIA_Code: E96; SizeX_mm: 1; SizeY_mm: 0.5; SizeZ_mm: 0.6; Value2: 0.063W; AEC Qualified: Y; VDC_V: 50V; AEC Grade: 0; AEC Category: Q200; ComponentLink1URL: http://www.vishay.com/docs/20035/dcrcwe3.pdf; Supplier Part Number 2: 52K7304; Supplier 2: Newark; Supplier Part Number 3: 71-CRCW0402-82.5K-E3; Supplier 3: Mouser; RoHS: E; Value1: 1%; MountType: SMT; Supplier 1: Digi-Key; PackageReference: 0402; Tolerance_%: 1%; Res_ohm: 82.5k; SizeArea_mm2: 0.5; CompType: Resistor; PartNumber: CRCW040282K5FKED; ComponentLink1Description: Datasheet link; Supplier Part Number 1: 541-82.5KLCT-ND; Technology: Thick Film
SW1 = CMP-0096333-1: Slide Switch SPDT Surface Mount, Right Angle; Manufacturer: C&K Switches; Coil Resistance_ohm: 80mΩ; SizeZ_mm: 1.5mm; AEC Qualified: No; VDC_V: 12V; Contact Current Rating: 100mA; Electromechanical Life: 10000Cycles; Datasheet Path: datasheets/Switch-AYZ0102AGRLC.pdf; Supplier 2: Mouser; Part Number: AYZ0102AGRLC; datasheet: https://www.ckswitches.com/media/1431/ayz.pdf; Lead Free: Yes; helpURL: https://upverter.com/upn/revision/0b48ea421d8a1f89/; Mouser Part Number: 611-AYZ0102AGRLC; Supplier Part Number 2: 611-AYZ0102AGRLC; MountType: Surface Mount; Digikey Part Number: 401-2012-1-ND; PackageReference: SMT_SW_7MM2_5MM3; Digikey Description: SWITCH SLIDE SPDT 100MA 12V; RoHS: TRUE; Mouser Description: Slide Switches SPDT SMT 1.2A SUBMIN; PartNumber: AYZ0102AGRLC; Supplier Part Number 1: 401-2012-1-ND; Circuit: SPDT; ComponentLink1URL: https://www.ckswitches.com/media/1431/ayz.pdf; Supplier 1: Digikey; Operating Temperature Range: -10°C to +60°C; ComponentLink1Description: Datasheet
U4 = CMP-0065473-1: USB to UART, SSOP-16; Manufacturer: FTDI; SizeZ_mm: 1.75; SizeX_mm: 5.99; SizeY_mm: 4.9; SizeArea_mm2: 29.351; SizeAreaWB_mm2: 55.131; ComponentLink1URL: http://www.ftdichip.com/Support/Documents/DataSheets/ICs/DS_FT230X.pdf; Publisher: Texas Instruments; Supplier Part Number 2: 895-FT230XS-R; Supplier 1: Digi-Key; PackageReference: SSOP-16; LatestRevisionDate: 2017-06-05; RoHS: Y; Supplier Part Number 1: 768-1135-1-ND; MountType: SMT; Supplier 2: Mouser; PartNumber: FT230XS-R; ComponentLink1Description: Datasheet URL
U5 = CMP-0043115-3: 4-Channel ESD Protection Array for High-Speed Data Interfaces, DRY0006A (USON-6); Manufacturer: Texas Instruments; IO Leakage Current(nA): 1; USB High Speed: TRUE; IO Capacitance(Typ)(pF): 1.6; Eco-Plan: Green (RoHS & no Sb/Br); IEC 61000-4-2 Contact(+/- kV): 8; Breakdown Voltage(Min)(V): 6; IEC 61000-4-2 Air-Gap(+/- kV): 12; AEC Category: Q200; AEC Qualified: N; CompType: IC; SizeAreaWB_mm2: 4.9; SizeArea_mm2: 1.45; SizeX_mm: 1.0; SizeZ_mm: 0.6; Rating: Catalog; ComponentLink3URL: http://www.ti.com/product/tpd4e004/datasheet; ComponentLink1Description: Datasheet Link; ComponentLink2URL: http://www.ti.com/product/tpd4e004; ComponentLink1URL: http://www.ti.com/lit/ds/symlink/tpd4e004.pdf; PackageDescription: USON-6; 1394 / Firewire: TRUE; PackageReference: DRY0006A; ComponentLink3Description: Online Datasheet; ComponentLink2Description: Product Folder; Serial ATA / eSATA: TRUE; PartNumber: TPD4E004DRYR; MountType: SMT; RoHS: Y; SizeY_mm: 1.45; Operating Temperature Range: -40 to 85 C